# EAGLE design ARC Doser (EAGLE 6.5.0)
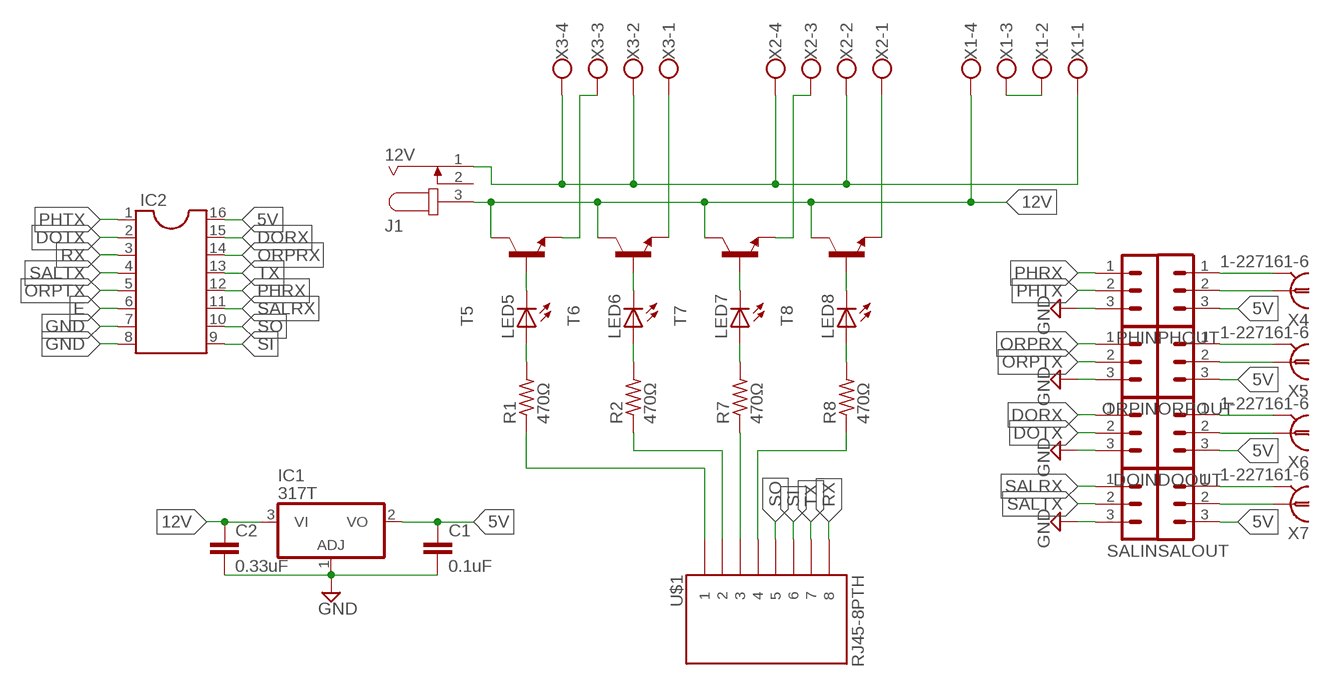
[diagram p0: schematic, sheet 1]

## Parts
C1  0.1uF  C5/3  [C5B3]
C2  0.33uF  C5/3  [C5B3]
DOIN  MA03-1  [MA03-1]
DOOUT  MA03-1  [MA03-1]
IC1  317T  [TO220H]
IC2  DIL16  [DIL16]
J1  12V  JACK-PLUG0  [SPC4077]
LED5  LED3MM  [LED3MM]
LED6  LED3MM  [LED3MM]
LED7  LED3MM  [LED3MM]
LED8  LED3MM  [LED3MM]
ORPIN  MA03-1  [MA03-1]
ORPOUT  MA03-1  [MA03-1]
PHIN  MA03-1  [MA03-1]
PHOUT  MA03-1  [MA03-1]
R1  470Ω  R-US_0204/7  [0204/7]
R2  470Ω  R-US_0204/7  [0204/7]
R7  470Ω  R-US_0204/7  [0204/7]
R8  470Ω  R-US_0204/7  [0204/7]
SALIN  MA03-1  [MA03-1]
SALOUT  MA03-1  [MA03-1]
T5  -NPN-TO92  [TO92]
T6  -NPN-TO92  [TO92]
T7  -NPN-TO92  [TO92]
T8  -NPN-TO92  [TO92]
U$1  RJ45-8PTH  [RJ45-8]
X1  W237-4  [W237-4]
X2  W237-4  [W237-4]
X3  W237-4  [W237-4]
X4  1-227161-6  [AMP_227161]
X5  1-227161-6  [AMP_227161]
X6  1-227161-6  [AMP_227161]
X7  1-227161-6  [AMP_227161]

## Nets
5V [1A]: C1.1 DOOUT.3 IC1.2(VO) IC2.16 ORPOUT.3 PHOUT.3 SALOUT.3
12V [1A]: C2.1 IC1.3(VI) J1.3 T5.3(C) T6.3(C) T7.3(C) T8.3(C) X1.4
DORX: DOIN.1 IC2.15
DOTX: DOIN.2 IC2.2
E: IC2.6
GND [1A]: C1.2 C2.2 DOIN.3 IC1.1(ADJ) IC2.7 IC2.8 J1.1 ORPIN.3 PHIN.3 SALIN.3 X1.1 X2.2 X2.4 X3.2 X3.4
N$1 [1A]: R7.1 U$1.3
N$2 [1A]: T5.1(E) X3.3
N$3 [1A]: T6.1(E) X3.1
N$4: R8.1 U$1.4
N$5 [1A]: LED5.A R1.2
N$6 [1A]: R2.1 U$1.2
N$7 [1A]: R1.1 U$1.1
N$8 [1A]: T7.1(E) X2.3
N$9 [1A]: T8.1(E) X2.1
N$10: PHOUT.1 X4.2
N$11: ORPOUT.1 X5.2
N$12 [1A]: LED5.K(C) T5.2(B)
N$13 [1A]: LED6.A R2.2
N$14: DOOUT.1 X6.2
N$15: SALOUT.1 X7.2
N$16: PHOUT.2 X4.1
N$17 [1A]: X1.2 X1.3
N$18: ORPOUT.2 X5.1
N$19: DOOUT.2 X6.1
N$20: SALOUT.2 X7.1
N$21 [1A]: LED6.K(C) T6.2(B)
N$32 [1A]: LED7.A R7.2
N$33 [1A]: LED7.K(C) T7.2(B)
N$34 [1A]: LED8.K(C) T8.2(B)
N$35 [1A]: LED8.A R8.2
ORPRX: IC2.14 ORPIN.1
ORPTX: IC2.5 ORPIN.2
PHRX: IC2.12 PHIN.1
PHTX: IC2.1 PHIN.2
RX: IC2.3 U$1.8
SALRX: IC2.11 SALIN.1
SALTX: IC2.4 SALIN.2
SI: IC2.9 U$1.6
SO: IC2.10 U$1.5
TX: IC2.13 U$1.7
Unconnected: J1.2

## Library data of the parts
C1 C2 = capacitor-wima:C: CAPACITOR naming: grid - package width
DOIN DOOUT ORPIN ORPOUT PHIN PHOUT SALIN SALOUT = con-lstb:MA03-1: PIN HEADER; OC_FARNELL: unknown; OC_NEWARK: unknown
IC1 = linear:*317: Positive VOLTAGE REGULATOR
IC2 = ic-package:DIL16: Dual In Line / Socket
J1 = con-jack:JACK-PLUG: DC POWER JACK Power Jack, DC, Right Angle, Through Hole, Rated 5A at 16VDC, PC Terminals Distributor: Farnell (www.Farnell.de) Drawing: 84N1161.pdf / 84N1162.pdf Manufacturer: SPC Technology (www.spctechnology.com) Type: SPC4077 / SPC 4078; OC_FARNELL: unknown; OC_NEWARK: unknown
LED5-LED8 = led:LED: LED OSRAM: - CHIPLED LG R971, LG N971, LY N971, LG Q971, LY Q971, LO R971, LY R971 LH N974, LH R974 LS Q976, LO Q976, LY Q976 LO Q996 - Hyper CHIPLED LW Q18S LB Q993, LB Q99A, LB R99A - SideLED LS A670, LO A670, LY A670, LG A670, LP A670 LB A673, LV A673, LT A673, LW A673 LH A674 LY A675 LS A676, LA A676, LO A676, LY A676, LW A676 LS A679, LY A679, LG A679 - Hyper Micro SIDELED® LS Y876, LA Y876, LO Y876, LY Y876 LT Y87S - SmartLED LW L88C, LW L88S LB L89C, LB L89S, LG L890 LS L89K, LO L89K, LY L89K LS L896, LA L896, LO L896, LY L896 - TOPLED LS T670, LO T670, LY T670, LG T670, LP T670 LSG T670, LSP T670, LSY T670, LOP T670, LYG T670 LG T671, LOG T671, LSG T671 LB T673, LV T673, LT T673, LW T673 LH T674 LS T676, LA T676, LO T676, LY T676, LB T676, LH T676, LSB T676, LW T676 LB T67C, LV T67C, LT T67C, LS T67K, LO T67K, LY T67K, LW E67C LS E67B, LA E67B, LO E67B, LY E67B, LB E67C, LV E67C, LT E67C LW T67C LS T679, LY T679, LG T679 LS T770, LO T770, LY T770, LG T770, LP T770 LB T773, LV T773, LT T773, LW T773 LH T774 LS E675, LA E675, LY E675, LS T675 LS T776, LA T776, LO T776, LY T776, LB T776 LHGB T686 LT T68C, LB T68C - Hyper Mini TOPLED® LB M676 - Mini TOPLED Santana® LG M470 LS M47K, LO M47K, LY M47K Source: http://www.osram.convergy.de LUXEON: - LUMILED® LXK2-PW12-R00, LXK2-PW12-S00, LXK2-PW14-U00, LXK2-PW14-V00 LXK2-PM12-R00, LXK2-PM12-S00, LXK2-PM14-U00 LXK2-PE12-Q00, LXK2-PE12-R00, LXK2-PE12-S00, LXK2-PE14-T00, LXK2-PE14-U00 LXK2-PB12-K00, LXK2-PB12-L00, LXK2-PB12-M00, LXK2-PB14-N00, LXK2-PB14-P00, LXK2-PB14-Q00 LXK2-PR12-L00, LXK2-PR12-M00, LXK2-PR14-Q00, LXK2-PR14-R00 LXK2-PD12-Q00, LXK2-PD12-R00, LXK2-PD12-S00 LXK2-PH12-R00, LXK2-PH12-S00 LXK2-PL12-P00, LXK2-PL12-Q00, LXK2-PL12-R00 Source: www.luxeon.com KINGBRIGHT: KA-3528ASYC Source: www.kingbright.com
R1 R2 R7 R8 = resistor:R-US_: RESISTOR, American symbol
T5-T8 = transistor:*-NPN-: NPN Transistror BF959 corrected 2008.03.06
U$1 = SparkFun-Connectors:RJ45-8: RJ45 Jack Simple RJ45, 8-pin connection - connector for common Cat5, Cat5e, and Cat6 Ethernet cables. Footprint not yet proven in production. Connector sku is PRT-00643; Breakout PCB sku is BOB-00716.
X1-X3 = con-wago-500:W237-4: WAGO SCREW CLAMP; OC_FARNELL: unknown; OC_NEWARK: unknown
X4-X7 = con-coax:?227161*: JACK, RIGHT ANGLE, 50 OHM, PCB, BNC Source: amp_227161.pdf; MF: TYCO ELECTRONICS; MPN: 1-227161-6; OC_FARNELL: unknown; OC_NEWARK: 09H7854

## Net classes
0 default: width 0.508 mm, drill 0.508 mm, clearance 0.508 mm
1 1A: width 0.762 mm, drill 0.762 mm, clearance 0.762 mm

## Board
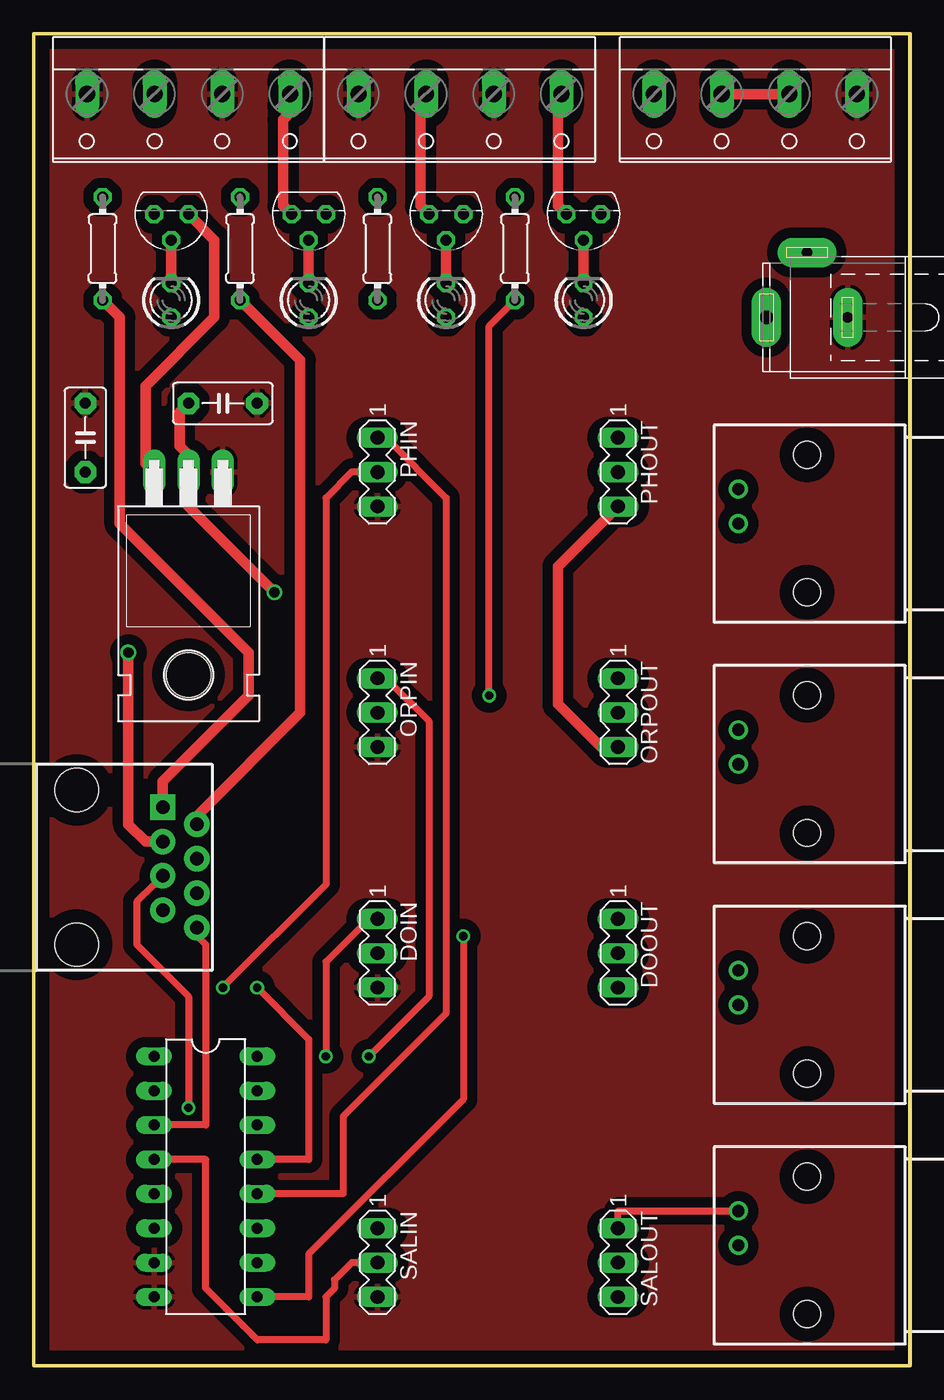
[diagram p1: board, top side]
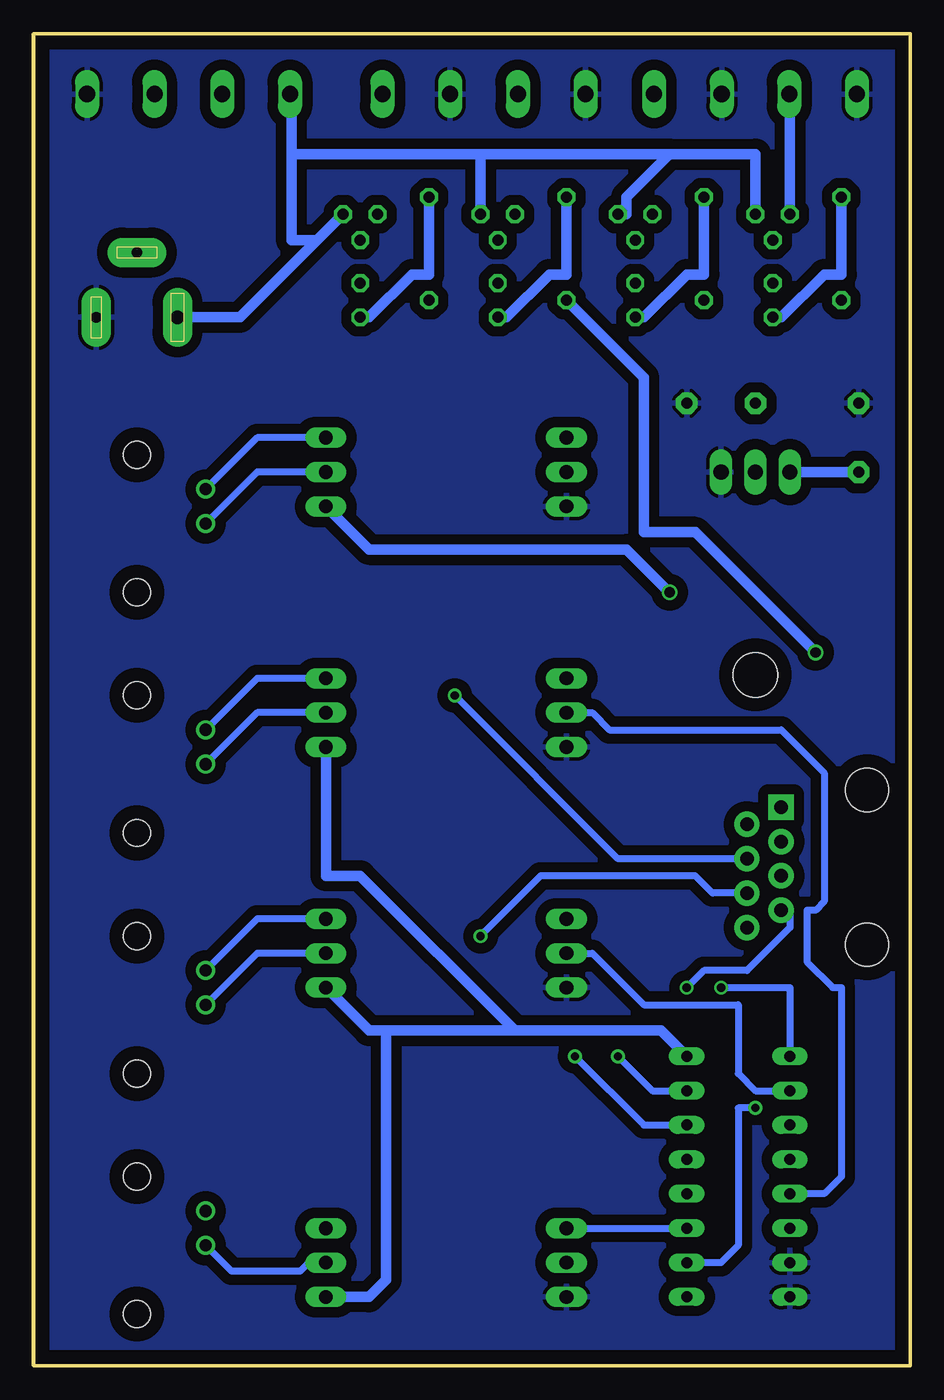
[diagram p2: board, bottom side, seen from below]

Size 64.77 x 98.43 mm. Coordinates in mm from the lower left corner, seen from the top.
Outline: 64.77,98.43 0,98.43 0,0 64.77,0 64.77,98.43
Copper layers (1*16): Top 0.035mm / dielectric 1.5mm / Bottom 0.035mm
Design rules "default": minimum track width 10mil, minimum drill 24mil, track to track 8mil, track to pad 8mil, pad to pad 8mil, via to via 8mil, smd to smd 8mil, copper to edge 40mil, drill to drill 8mil, minimum pad ring 10mil, minimum via ring 8mil, stop-mask expansion 4mil, vias tented up to drill 0mil, thermal gap 10mil

### Footprints (pad centres in the part's own frame; a part is rotated, then mirrored left to right if it is on the bottom)
C5B3 = drill 0.813 pad 1.6 octagon: 1 -2.54,0; 2 2.54,0
MA03-1 = drill 1.016 long: 1 -2.54,0; 2 0,0; 3 2.54,0
TO220H = drill 1.118 long: 1 -2.54,-10.16; 2 0,-10.16; 3 2.54,-10.16 | hole 3.302: 0,4.826
DIL16 = drill 0.813 long: 1 -8.89,-3.81; 2 -6.35,-3.81; 3 -3.81,-3.81; 4 -1.27,-3.81; 5 1.27,-3.81; 6 3.81,-3.81; 7 6.35,-3.81; 8 8.89,-3.81; 9 8.89,3.81; 10 6.35,3.81; 11 3.81,3.81; 12 1.27,3.81; 13 -1.27,3.81; 14 -3.81,3.81; 15 -6.35,3.81; 16 -8.89,3.81
SPC4077 = drill 0.8 pad 2.184 long: 1 -3,0; 2 0,-4.8 | drill 1 pad 2.184 long: 3 3,0
LED3MM = drill 0.813 octagon: A -1.27,0; K 1.27,0
0204/7 = drill 0.813 octagon: 1 -3.81,0; 2 3.81,0
TO92 = drill 0.813 octagon: 1 1.27,0; 2 0,1.905; 3 -1.27,0
RJ45-8 = drill 1 pad 1.88 square: 1 -4.445,6.35 | drill 1 pad 1.88: 2 -3.175,8.89; 3 -1.905,6.35; 4 -0.635,8.89; 5 0.635,6.35; 6 1.905,8.89; 7 3.175,6.35; 8 4.445,8.89 | hole 3.2: -5.715,0; 5.715,0
W237-4 = drill 1.194 long: 1 -7.5,-1.27; 2 -2.5,-1.27; 3 2.5,-1.27; 4 7.5,-1.27
AMP_227161 = drill 0.9 pad 1.27: 1 0,-5.08; 2 -2.54,-5.08 | hole 2: -5.08,0; 5.08,0

### Placement (x,y rotation side)
C1  13.97,71.12 0 top
C2  3.81,68.58 90 top
DOIN  25.4,30.48 270 top
DOOUT  43.18,30.48 270 top
IC1  11.43,55.88 180 top
IC2  12.7,13.97 270 top
J1  57.15,77.47 180 top
LED5  10.16,78.74 90 top
LED6  20.32,78.74 90 top
LED7  30.48,78.74 90 top
LED8  40.64,78.74 90 top
ORPIN  25.4,48.26 270 top
ORPOUT  43.18,48.26 270 top
PHIN  25.4,66.04 270 top
PHOUT  43.18,66.04 270 top
R1  5.08,82.55 90 top
R2  15.24,82.55 90 top
R7  25.4,82.55 90 top
R8  35.56,82.55 90 top
SALIN  25.4,7.62 270 top
SALOUT  43.18,7.62 270 top
T5  10.16,85.09 180 top
T6  20.32,85.09 180 top
T7  30.48,85.09 180 top
T8  40.64,85.09 180 top
U$1  3.17,36.83 270 top
X1  53.34,92.71 180 top
X2  31.5,92.71 180 top
X3  11.43,92.71 180 top
X4  57.15,62.23 270 top
X5  57.15,44.45 270 top
X6  57.15,26.67 270 top
X7  57.15,8.89 270 top

### Tracks (layer width: path | path; a pad name or v marks a point on that pad's centre or on a via)
5V  (via drill 0.76)
  Top 0.762: C1.1 10.8,70.48 10.8,67.95 11.43,67.31 IC1.2 11.43,63.5 v17.78,57.15 | PHOUT.3 38.73,59.06 38.73,48.9 41.91,45.72 ORPOUT.3
  Bottom 0.762: IC2.16 18.41,24.77 29.21,24.77 | 38.73,24.77 40.01,24.77 DOOUT.3 | 38.73,24.77 29.21,24.77 | SALOUT.3 40.01,5.08 38.73,6.35 38.73,24.77 | ORPOUT.3 43.18,36.2 40.64,36.2 29.21,24.77 | v17.78,57.15 20.95,60.33 40.01,60.33 PHOUT.3
12V
  Top 0.762: IC1.3 8.25,66.67 8.25,72.39 13.34,77.47 13.34,83.19 T5.3
  Bottom 0.762: 43.81,83.19 49.53,77.47 J1.3 | 43.81,83.19 T8.3 | 45.72,89.53 45.72,83.19 43.81,83.19 | 45.72,89.53 45.72,93.98 X1.4 | IC1.3 C2.1 | T5.3 11.43,89.53 17.78,89.53 | 17.78,89.53 20.95,86.36 20.95,85.09 T6.3 | 31.75,89.53 T7.3 | 17.78,89.53 31.75,89.53 | 31.75,89.53 45.72,89.53
DORX  (via drill 0.61)
  Top 0.508: v21.59,22.86 21.59,29.85 24.77,33.02 DOIN.1
  Bottom 0.508: IC2.15 19.05,20.32 v21.59,22.86
DOTX
  Bottom 0.508: IC2.2 11.43,20.32 12.7,21.59 12.7,26.67 19.69,26.67 23.49,30.48 DOIN.2
GND
  pour Bottom: 0,98.43 64.77,98.43 64.77,0 0,0
  pour Top: 0,98.43 64.77,98.43 64.77,0 0,0
N$1  (via drill 0.76)
  Top 0.762: v6.98,52.7 6.98,40.01 8.25,38.73 U$1.3
  Bottom 0.762: R7.1 19.69,73.03 19.69,61.59 15.88,61.59 v6.98,52.7
N$2
  Bottom 0.762: T5.1 8.89,93.98 X3.3
N$3
  Top 0.762: T6.1 18.41,85.73 18.41,92.08 19.05,92.71 19.05,93.98 X3.1
N$4  (via drill 0.61)
  Top 0.508: R8.1 33.66,76.84 v33.66,49.53
  Bottom 0.508: v33.66,49.53 21.59,37.47 U$1.4
N$5
  Bottom 0.762: R1.2 5.08,80.65 6.35,80.65 9.52,77.47 LED5.A
N$6
  Top 0.762: R2.1 19.69,74.3 19.69,48.26 12.06,40.64 U$1.2
N$7
  Top 0.762: R1.1 6.35,77.47 6.35,62.23 15.88,52.7 15.88,49.53 9.52,43.18 U$1.1
N$8
  Top 0.762: T7.1 28.58,85.73 28.58,93.98 X2.3
N$9
  Top 0.762: T8.1 38.73,85.73 38.73,93.98 X2.1
N$10
  Bottom 0.508: X4.2 48.26,68.58 PHOUT.1
N$11
  Bottom 0.508: X5.2 48.26,50.8 ORPOUT.1
N$12
  Top 0.762: T5.2 LED5.K
N$13
  Bottom 0.762: R2.2 15.24,80.65 16.51,80.65 19.69,77.47 LED6.A
N$14
  Bottom 0.508: X6.2 48.26,33.02 DOOUT.1
N$15
  Top 0.508: X7.2 43.18,11.43 SALOUT.1
N$16
  Bottom 0.508: X4.1 48.26,66.04 PHOUT.2
N$17
  Top 0.762: X1.2 X1.3
N$18
  Bottom 0.508: X5.1 48.26,48.26 ORPOUT.2
N$19
  Bottom 0.508: X6.1 48.26,30.48 DOOUT.2
N$20
  Bottom 0.508: X7.1 50.16,6.98 45.09,6.98 44.45,7.62 SALOUT.2
N$21
  Top 0.762: T6.2 LED6.K
N$32
  Bottom 0.762: R7.2 25.4,80.65 26.67,80.65 29.84,77.47 LED7.A
N$33
  Top 0.762: T7.2 LED7.K
N$34
  Top 0.762: T8.2 LED8.K
N$35
  Bottom 0.762: R8.2 35.56,80.65 36.83,80.65 40.01,77.47 LED8.A
ORPRX  (via drill 0.61)
  Top 0.508: v24.77,22.86 29.21,27.3 29.21,47.62 26.04,50.8 ORPIN.1
  Bottom 0.508: IC2.14 19.69,17.78 v24.77,22.86
ORPTX
  Bottom 0.508: IC2.5 6.35,12.7 5.08,13.97 5.08,27.94 5.72,27.94 7.62,29.85 7.62,33.66 6.98,33.66 6.35,34.29 6.35,43.82 9.52,46.99 22.23,46.99 23.49,48.26 ORPIN.2
PHRX
  Top 0.508: IC2.12 22.86,12.7 22.86,18.42 30.48,26.04 30.48,64.14 26.04,68.58 PHIN.1
PHTX  (via drill 0.61)
  Top 0.508: v13.97,27.94 21.59,35.56 21.59,64.14 23.49,66.04 PHIN.2
  Bottom 0.508: IC2.1 8.89,27.94 v13.97,27.94
RX
  Top 0.508: IC2.3 12.7,17.78 12.7,31.12 12.06,31.75 U$1.8
SALRX
  Bottom 0.508: SALIN.1 IC2.11
SALTX
  Top 0.508: IC2.4 12.7,15.24 12.7,5.72 16.51,1.91 21.59,1.91 21.59,5.08 22.23,5.72 22.23,6.35 23.49,7.62 SALIN.2
SI  (via drill 0.61)
  Top 0.508: IC2.9 20.32,5.08 20.32,8.26 31.75,19.69 v31.75,31.75
  Bottom 0.508: v31.75,31.75 27.3,36.2 15.88,36.2 14.61,34.93 U$1.6
SO  (via drill 0.61)
  Top 0.508: v11.43,19.05 11.43,27.3 7.62,31.12 7.62,34.29 8.89,35.56 9.52,35.56 U$1.5
  Bottom 0.508: IC2.10 13.97,7.62 12.7,8.89 12.7,19.05 v11.43,19.05
TX  (via drill 0.61)
  Top 0.508: IC2.13 20.32,15.24 20.32,24.13 v16.51,27.94
  Bottom 0.508: v16.51,27.94 15.24,29.21 12.06,29.21 8.89,32.39 8.89,33.66 U$1.7